# EAGLE design untitled (EAGLE 6.1)
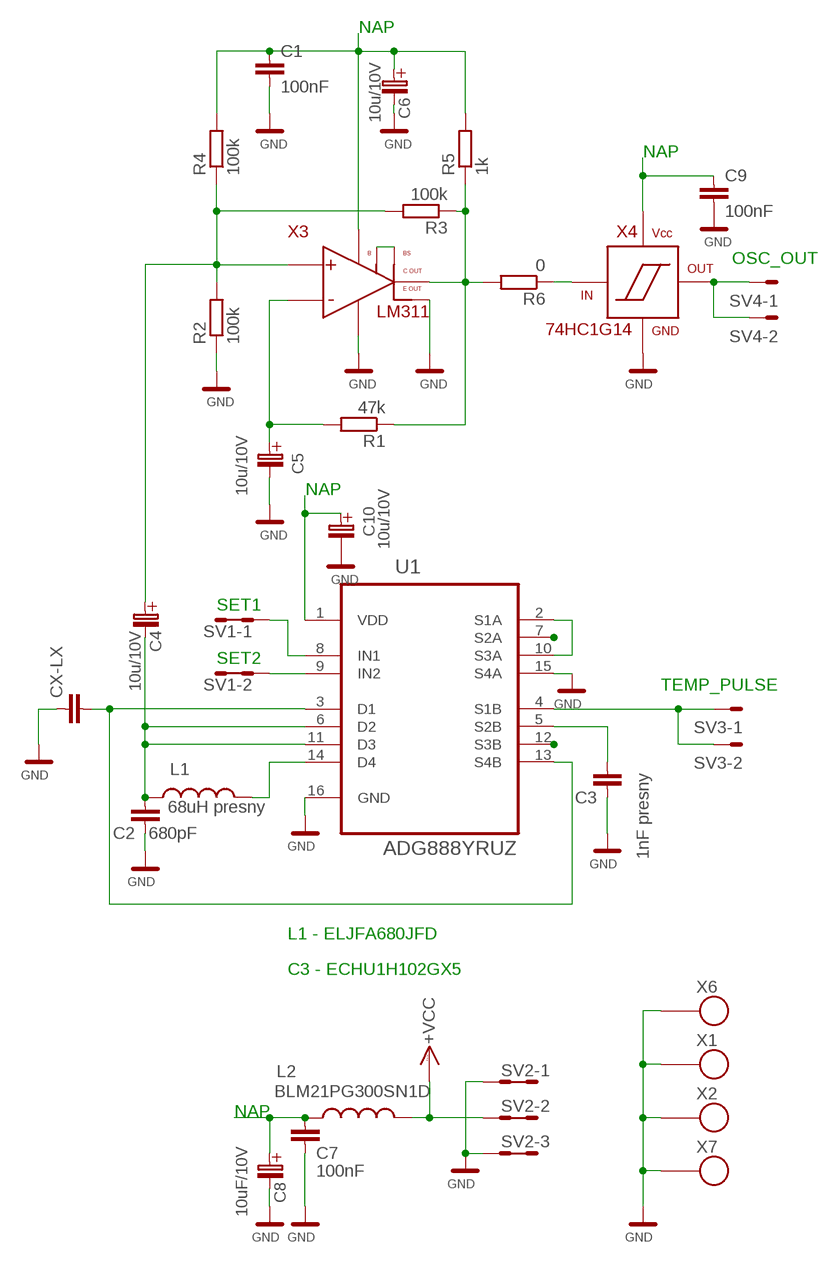
[diagram p0: schematic, sheet 1]

## Parts
C1  100nF  C0805  [C0805]
C2  680pF  C0805  [C0805]
C3  1nF presny  C0805  [C0805]
C4  10u/10V  B  [B]
C5  10u/10V  B  [B]
C6  10u/10V  B  [B]
C7  100nF  C0805  [C0805]
C8  10uF/10V  B  [B]
C9  100nF  C0805  [C0805]
C10  10u/10V  B  [B]
CX-LX  SPEC_805  [SPEC_805]
L1  68uH presny  L1210  [1210]
L2  BLM21PG300SN1D  L1210  [1210]
R1  47k  R0805  [0805]
R2  100k  R0805  [0805]
R3  100k  R0805  [0805]
R4  100k  R0805  [0805]
R5  1k  R0805  [0805]
R6  0  R0805  [0805]
SV1  MA02-2  [MA02-2]
SV2  MA03-2  [MA03-2]
SV3  MA02-1  [MA02-1]
SV4  MA02-1  [MA02-1]
U1  ADG888YRUZ  [SOP65P640X120-16N]
X1  SROUB3M  [SROUB3M]
X2  SROUB3M  [SROUB3M]
X3  LM311  [SO8]
X4  74HC1G14  [SOT353]
X6  SROUB3M  [SROUB3M]
X7  SROUB3M  [SROUB3M]

## Nets
C+: CX-LX.2 U1.3(D1) U1.13(S4B)
GND: C1.2 C2.1 C3.1 C5.-(C_EL-) C6.-(C_EL-) C7.2 C8.-(C_EL-) C9.2 C10.-(C_EL-) CX-LX.1 R2.1 SV2.1 SV2.2 SV2.5 SV2.6 U1.15(S4A) U1.16(GND) X1.P$1 X2.P$1 X3.1(E_OUT) X3.4(GND) X4.3(GND) X6.P$1 X7.P$1
N$2: R5.2
N$3: C2.2 C4.-(C_EL-) L1.P$1 U1.6(D2) U1.11(D3)
N$4: X3.5(B) X3.6(BS)
N$5: U1.7(S2A)
N$6: C3.2 U1.5(S2B)
N$7: U1.2(S1A) U1.10(S3A)
N$8: SV1.1 SV1.2 U1.8(IN1)
N$9: SV3.1 SV3.2 U1.4(S1B)
N$10: L1.P$2 U1.14(D4)
N$11: U1.12(S3B)
N$12: C5.+(C_EL+) R1.2 X3.3(-)
N$13: R1.1 R3.1 R5.1 R6.2 X3.7(VOUT)
N$14: SV1.3 SV1.4 U1.9(IN2)
N$15: R6.1 X4.2(IN)
N$16: C4.+(C_EL+) R2.2 R3.2 R4.1 X3.2(+)
N$17: SV4.1 SV4.2 X4.4(OUT)
NAP: C1.1 C6.+(C_EL+) C7.1 C8.+(C_EL+) C9.1 C10.+(C_EL+) L2.P$1 R4.2 U1.1(VDD) X3.8(VDD) X4.5(VCC)
VCC: L2.P$2 SV2.3 SV2.4 ; supply symbol labelled +VCC

## Notes on the sheet
- NAP
- NAP
- OSC_OUT
- NAP
- SET1
- SET2
- TEMP_PULSE
- L1 - ELJFA680JFD
- C3 - ECHU1H102GX5
- NAP

## Library data of the parts
C1-C3 C7 C9 = moje_C:C0805
C4-C6 C8 C10 = moje_C:B
CX-LX = moje_C:SPEC_805
L1 L2 = moje_L:L1210
R1-R6 = moje_R:R0805
SV1 = moje_hrebinky:MA02-2
SV2 = moje_hrebinky:MA03-2: PIN HEADER; OC_FARNELL: unknown; OC_NEWARK: unknown
SV3 SV4 = moje_hrebinky:MA02-1
U1 = moje_tlacitka:ADG888YRUZ: 0.4 Ù CMOS, Dual DPDT Switch; MPN: ADG888YRUZ; OC_FARNELL: 1117866; OC_NEWARK: 19M0698; PACKAGE: TSSOP-16; SUPPLIER: Analog Devices
X1 X2 X6 X7 = moje:SROUB3M
X3 = moje_komp:LM311
X4 = moje_komp:74HC1G14: Schmitt, Trigger

## Board
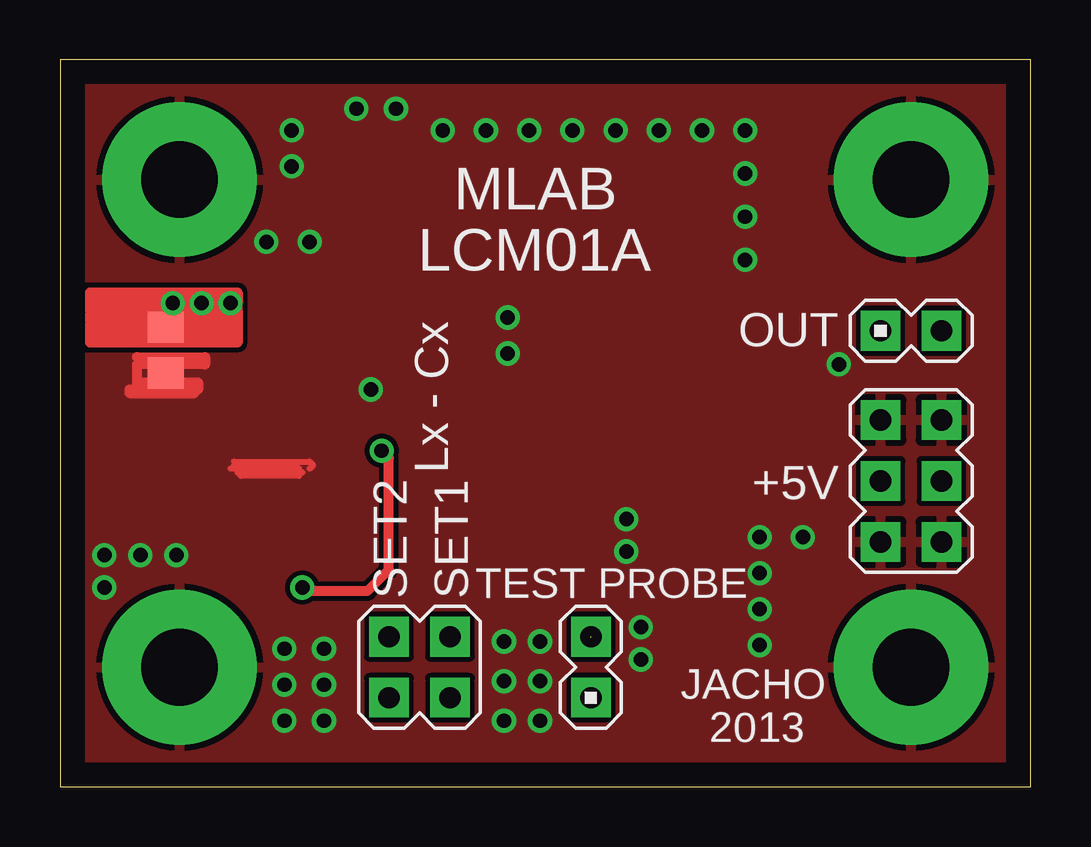
[diagram p1: board, top side]
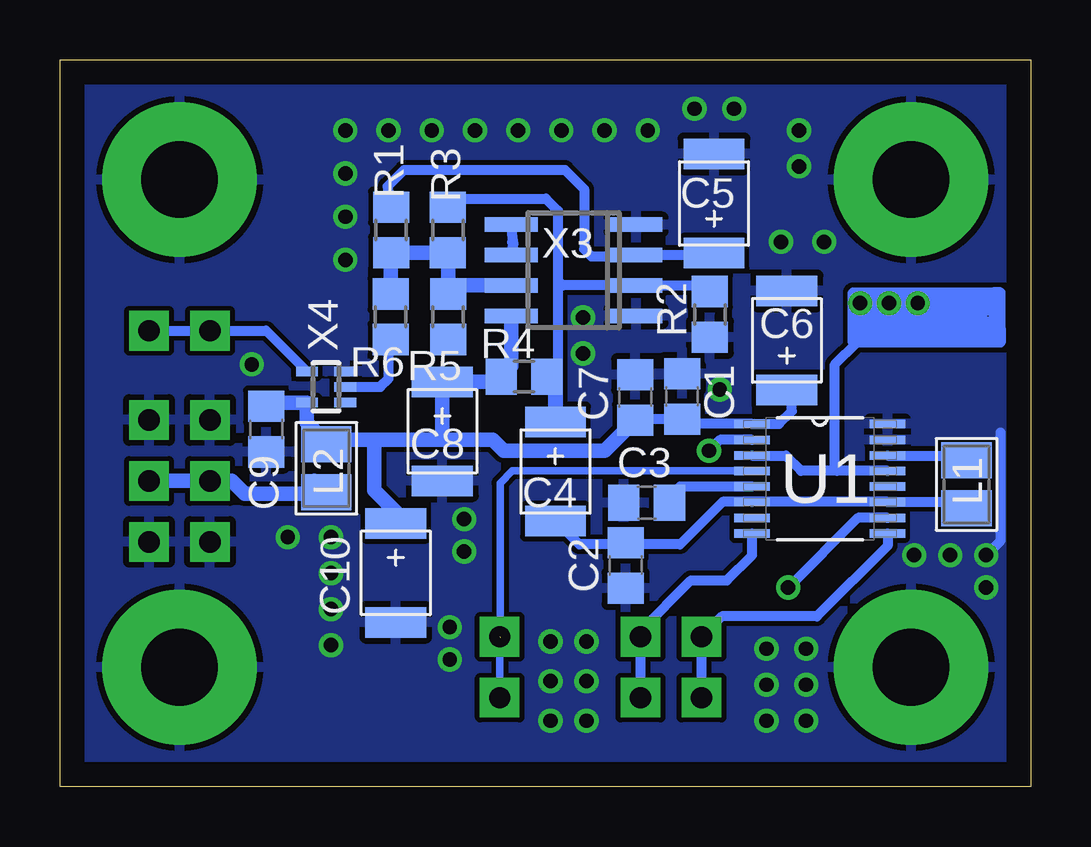
[diagram p2: board, bottom side, seen from below]

Size 40.44 x 30.28 mm. Coordinates in mm from the lower left corner, seen from the top.
Outline: 0,0 40.44,0 40.44,30.28 0,30.28 0,0
Copper layers (1*16): Top 0.035mm / dielectric 1.5mm / Bottom 0.035mm
Design rules: minimum track width 10mil, minimum drill 24mil, track to track 8mil, track to pad 8mil, pad to pad 8mil, via to via 8mil, smd to smd 8mil, copper to edge 40mil, drill to drill 8mil, minimum pad ring 10mil, minimum via ring 8mil, stop-mask expansion 4mil, vias tented up to drill 0mil, thermal gap 10mil

### Footprints (pad centres in the part's own frame; a part is rotated, then mirrored left to right if it is on the bottom)
C0805 = smd 1.3 x 1.5: 1 -0.95,0; 2 0.95,0
B = smd 1.27 x 2.54: + 2.223,0; - -1.905,0
SPEC_805 = smd 1.3 x 1.5: 1 -0.95,0; 2 0.95,0
1210 = smd 1.5 x 2.1: P$1 -1,0; P$2 1,0
0805 = smd 1.3 x 1.5: 1 -0.95,0; 2 0.95,0
MA02-2 = drill 0.889 pad 1.651 square: 1 -1.27,-1.27; 2 -1.27,1.27; 3 1.27,-1.27; 4 1.27,1.27
MA03-2 = drill 0.889 pad 1.651 square: 1 -2.54,-1.27; 2 -2.54,1.27; 3 0,-1.27; 4 0,1.27; 5 2.54,-1.27; 6 2.54,1.27
MA02-1 = drill 0.889 pad 1.651 square: 1 -1.27,0; 2 1.27,0
SOP65P640X120-16N = smd 1.473 x 0.356: 1 -2.819,2.286; 2 -2.819,1.626; 3 -2.819,0.965; 4 -2.819,0.33; 5 -2.819,-0.33; 6 -2.819,-0.965; 7 -2.819,-1.626; 8 -2.819,-2.286; 9 2.819,-2.286; 10 2.819,-1.626; 11 2.819,-0.965; 12 2.819,-0.33; 13 2.819,0.33; 14 2.819,0.965; 15 2.819,1.626; 16 2.819,2.286
SROUB3M = drill 3.2 pad 6.452: P$1 0,0
SO8 = smd 0.6 x 2.2: 1 -1.905,-2.6; 2 -0.635,-2.6; 3 0.635,-2.6; 4 1.905,-2.6; 5 1.905,2.6; 6 0.635,2.6; 7 -0.635,2.6; 8 -1.905,2.6
SOT353 = smd 0.4 x 0.9: 1 -0.65,-0.8; 2 0,-0.8; 3 0.65,-0.8; 4 0.65,0.8; 5 -0.65,0.8

### Placement (x,y rotation side)
C1  14.52,16.26 90 bottom
C2  16.87,9.22 90 bottom
C3  15.99,11.83 0 bottom
C4  19.79,12.97 90 bottom
C5  13.19,24.46 270 bottom
C6  10.16,18.75 270 bottom
C7  16.47,16.22 90 bottom
C8  24.5,14.65 90 bottom
C9  31.85,14.9 270 bottom
C10  26.45,8.75 90 bottom
CX-LX  4.4,18.19 90 top
L1  2.67,12.6 90 bottom
L2  29.34,13.27 270 bottom
R1  26.64,23.2 90 bottom
R2  13.36,19.68 90 bottom
R3  24.28,23.2 90 bottom
R4  21.11,17.09 180 bottom
R5  24.27,19.58 270 bottom
R6  26.66,19.58 90 bottom
SV1  14.98,4.98 180 top
SV2  35.46,12.74 90 top
SV3  22.12,4.98 270 top
SV4  35.46,19 180 top
U1  8.78,12.83 0 bottom
X1  4.98,4.98 0 top
X2  4.98,25.3 0 top
X3  19.04,21.52 90 bottom
X4  29.35,16.65 90 bottom
X6  35.46,25.3 0 top
X7  35.46,4.98 0 top

### Tracks (layer width: path | path; a pad name or v marks a point on that pad's centre or on a via)
C+  (via drill 0.6)
  Top 0.406: 7.1,19.4 1.25,19.4 | 1.25,19.4 1.25,19.7 | 1.25,19.85 1.25,20.15 | 1.25,20.15 1.25,20.6 7.4,20.6 7.4,20.3 | 7.4,20.3 7.4,20.15 | 7.4,19.85 7.4,19.55 | 7.4,19.55 7.1,19.85 1.25,19.85 | 1.25,19.85 1.25,19.7 | 1.25,19.7 7.25,19.7 7.4,19.85 | 7.4,19.85 7.4,20.15 | 7.4,20.15 v7.1,20.15 v5.9,20.15 v4.7,20.15 | v4.7,20.15 1.25,20.15 | 1.4,20.3 7.4,20.3 | 7.4,19.55 7.4,18.65 | 7.4,18.65 7.4,18.5 1.25,18.5 1.25,18.65 | 1.25,18.65 1.25,19.25 | 1.25,19.4 1.25,19.25 | 1.25,19.25 1.4,19.1 7.25,19.1 7.25,18.8 | 7.25,18.8 7.4,18.65 | 7.4,18.65 1.25,18.65 | 1.4,18.95 7.1,18.95 7.25,18.8 | CX-LX.2 4.4,19.85 v4.7,20.15
  Bottom 0.406: 8.06,13.16 9.56,13.16 10.2,13.79 U1.3 | U1.13 8.06,13.16 | 8.06,13.16 8.15,13.25 8.15,17.6 7.25,18.5 | 7.25,18.5 7.4,18.5 7.4,18.8 | 7.4,18.95 7.4,19.1 | 7.4,19.1 7.4,20.3 | 7.4,20.3 7.4,20.6 2.15,20.6 | 2.15,20.6 2.15,20.3 | 7.4,20.3 2.15,20.3 | 2.15,20.3 2.15,19.4 | 2.15,19.4 7.1,19.4 7.25,19.55 7.25,20.15 v7.1,20.15 v5.9,20.15 v4.7,20.15 2.3,20.15 2.3,20 2.45,19.85 6.95,19.85 7.1,20 7.1,19.7 6.95,19.55 2.3,19.55 | 2.15,19.4 1.25,19.4 | 1.25,19.4 1.25,20.6 1.55,20.6 | 2.15,20.6 1.55,20.6 | 1.55,20.6 1.4,20.45 1.85,20.45 2,20.3 2,20 1.85,19.85 | 1.85,19.85 1.7,19.85 1.55,19.7 1.55,19.85 | 1.55,19.85 1.85,20.15 1.85,19.85 | 1.85,19.85 2,19.7 | 1.55,19.85 1.55,20.3 | 7.4,19.1 1.25,19.1 | 1.25,19.1 1.25,19.4 | 1.25,19.1 1.25,18.95 | 1.25,18.8 1.25,18.5 7.25,18.5 | 7.4,18.8 7.4,18.95 | 7.4,18.95 1.25,18.95 | 1.25,18.95 1.25,18.8 | 1.25,18.8 7.4,18.8
GND  (via drill 0.6)
  Top 0.254: 7.25,13.55 10.4,13.55 10.55,13.4 10.4,13.25 | 7.25,13.4 9.8,13.4 9.95,13.25 9.95,12.95 7.55,12.95 7.4,13.1 9.95,13.1 | 10.1,13.1 9.95,13.1 | 9.95,13.1 9.8,13.25 7.1,13.25
  Top 0.406: 3.2,17.9 6.05,17.9 6.05,17.6 3.2,17.6 3.2,16.85 5.75,16.85 5.75,16.55 5.6,16.55 | 5.6,16.55 2.9,16.55 2.9,16.4 5.6,16.4 5.6,16.55
  Bottom 0.406: 1.25,14.75 1.25,10.25 v1.85,9.65
  other vias: 29.15,8.9 29.15,7.4 29.15,5.9 23.6,11.15 29.15,10.4 30.95,10.4 3.35,9.65 32.45,17.6 14,28.25 15.95,27.35 17.75,27.35 19.55,27.35 21.35,27.35 23.15,27.35 24.95,27.35 26.75,27.35 9.65,27.35 9.65,25.85 11,5.75 9.35,5.75 9.35,4.25 28.55,27.35 28.55,25.55 28.55,23.75 28.55,21.95 12.35,28.25 18.65,19.55 18.65,18.05 12.95,16.55 18.5,4.4 18.5,6.05 20,6.05 20,4.4 9.35,2.75 18.5,2.75 20,2.75 1.85,8.3 4.85,9.65 8.6,22.7 10.4,22.7 23.6,9.8 24.2,5.3 24.2,6.65 11,4.25 11,2.75
  pour Bottom: -0.2,-0.1 40.6,-0.1 40.6,30.2 -0.2,30.2
  pour Top: 0.2,30.2 -0.1,30.2 -0.1,-0.1 40.4,-0.1 40.4,30.2 0.5,30.2
N$3
  Bottom 0.406: L1.P$1 3.73,11.87 U1.11 U1.6 12.84,11.87 14.6,10.1 16.94,10.1 | 16.94,10.1 C2.2 | 16.94,10.1 18.8,10.1 19.7,11 20,11 19.93,11.07 C4.-
N$4
  Bottom 0.406: X3.6 21.54,22.64 21.6,22.7 21.56,22.7 X3.5
N$6
  Bottom 0.406: U1.5 14.6,12.5 15.05,12.05 | 15.05,12.05 15.2,11.9 | C3.2 15.04,12.04 15.05,12.05
N$7  (via drill 0.6)
  Top 0.406: v13.4,14 13.7,13.7 13.7,9.05 12.8,8.15 10.25,8.15 v10.1,8.3
  Bottom 0.406: 13.1,14.3 v13.4,14 12.94,14.46 U1.2 | U1.10 7.2,11.2 v10.1,8.3
N$8
  Bottom 0.406: SV1.2 SV1.1 16.25,6.5 14.15,8.6 12.65,8.6 11.6,9.65 U1.8
N$9  (1 unrouted)
  Bottom 0.305: U1.4 21.59,13.16 22.1,12.65 22.1,6.2 | SV3.1 SV3.2
N$10
  Bottom 0.406: U1.14 3.67,13.79 L1.P$2
N$12
  Bottom 0.406: 13.6,22.4 13.44,22.24 C5.+ 13.27,22.15 X3.3 16.4,22.2 16.5,22.1 18.3,22.1 18.6,22.4 18.6,24.9 19.4,25.7 26.1,25.7 26.79,25.01 R1.2
N$13
  Bottom 0.61: X3.7 23.91,20.88 R5.1 R3.1 R1.1 26.66,22.23 R6.2
N$14
  Bottom 0.406: SV1.4 SV1.3 12.86,7.1 8.9,7.1 5.96,10.04 U1.9
N$15
  Bottom 0.406: X4.2 27.09,16.65 26.75,17 26.75,18.5 26.6,18.65 26.64,18.65 R6.1
N$16
  Bottom 0.406: R2.2 13.62,20.88 X3.2 19.48,20.88 19.7,21.1 | R3.2 24.28,23.92 23.7,24.5 20.2,24.5 19.7,24 19.7,21.1 | 19.7,21.1 19.7,15.5 | 19.7,15.5 19.8,15.4 19.7,15.4 | C4.+ 19.7,15.5
  Bottom 0.61: 19.8,15.4 19.8,16.73 R4.1
N$17
  Bottom 0.406: SV4.1 SV4.2 31.85,19 X4.4
NAP
  Bottom 0.305: 31.85,16.1 31.75,16 31.75,15.95 C9.1 31.8,15.85 31.7,15.95
  Bottom 0.406: 29,14.62 L2.P$1 | 29.3,14.3 29,14.3 29,14.62 | 29,14.62 28.99,14.62 | 10.1,16.55 10.14,16.55 C6.+ | 9.95,16.55 9.95,15.65 10.48,15.12 U1.1 14.33,15.12 C1.1 16.43,15.31 C7.1 16.4,15.2 16.25,15.2
  Bottom 0.61: 31.75,16 X4.5 30.15,15.16 29.3,14.3 29.15,14.45 27.35,14.45 | 16.17,15.12 16.25,15.2 | 9.95,16.55 10.1,16.55 | 24.65,14.45 22.4,14.45 21.95,14 17.75,14 C7.1 | 24.65,14.45 27.35,14.45 | 24.65,14.45 24.5,14.6 C8.+ 22.28,16.87 R4.2 21.64,17.51 X3.8 | C10.+ 26.45,11.45 27.35,12.35 27.35,14.45
VCC
  Bottom 0.61: 29.84,12.74 29.37,12.27 | 29.37,12.27 29.3,12.2 29.3,12.5 | 29.37,12.27 L2.P$2 29.41,12.2 32.75,12.2 33.29,12.74 SV2.4 SV2.3
(copper drawn outside any net)
  shapes: Top area x1

### Text on the board
tPlace: MLAB | LCM01A | Lx - Cx | OUT | +5V | SET2 | SET1 | TEST PROBE | JACHO | 2013
bPlace: L2